# EAGLE schematic contact_control_board (EAGLE 6.5.0)
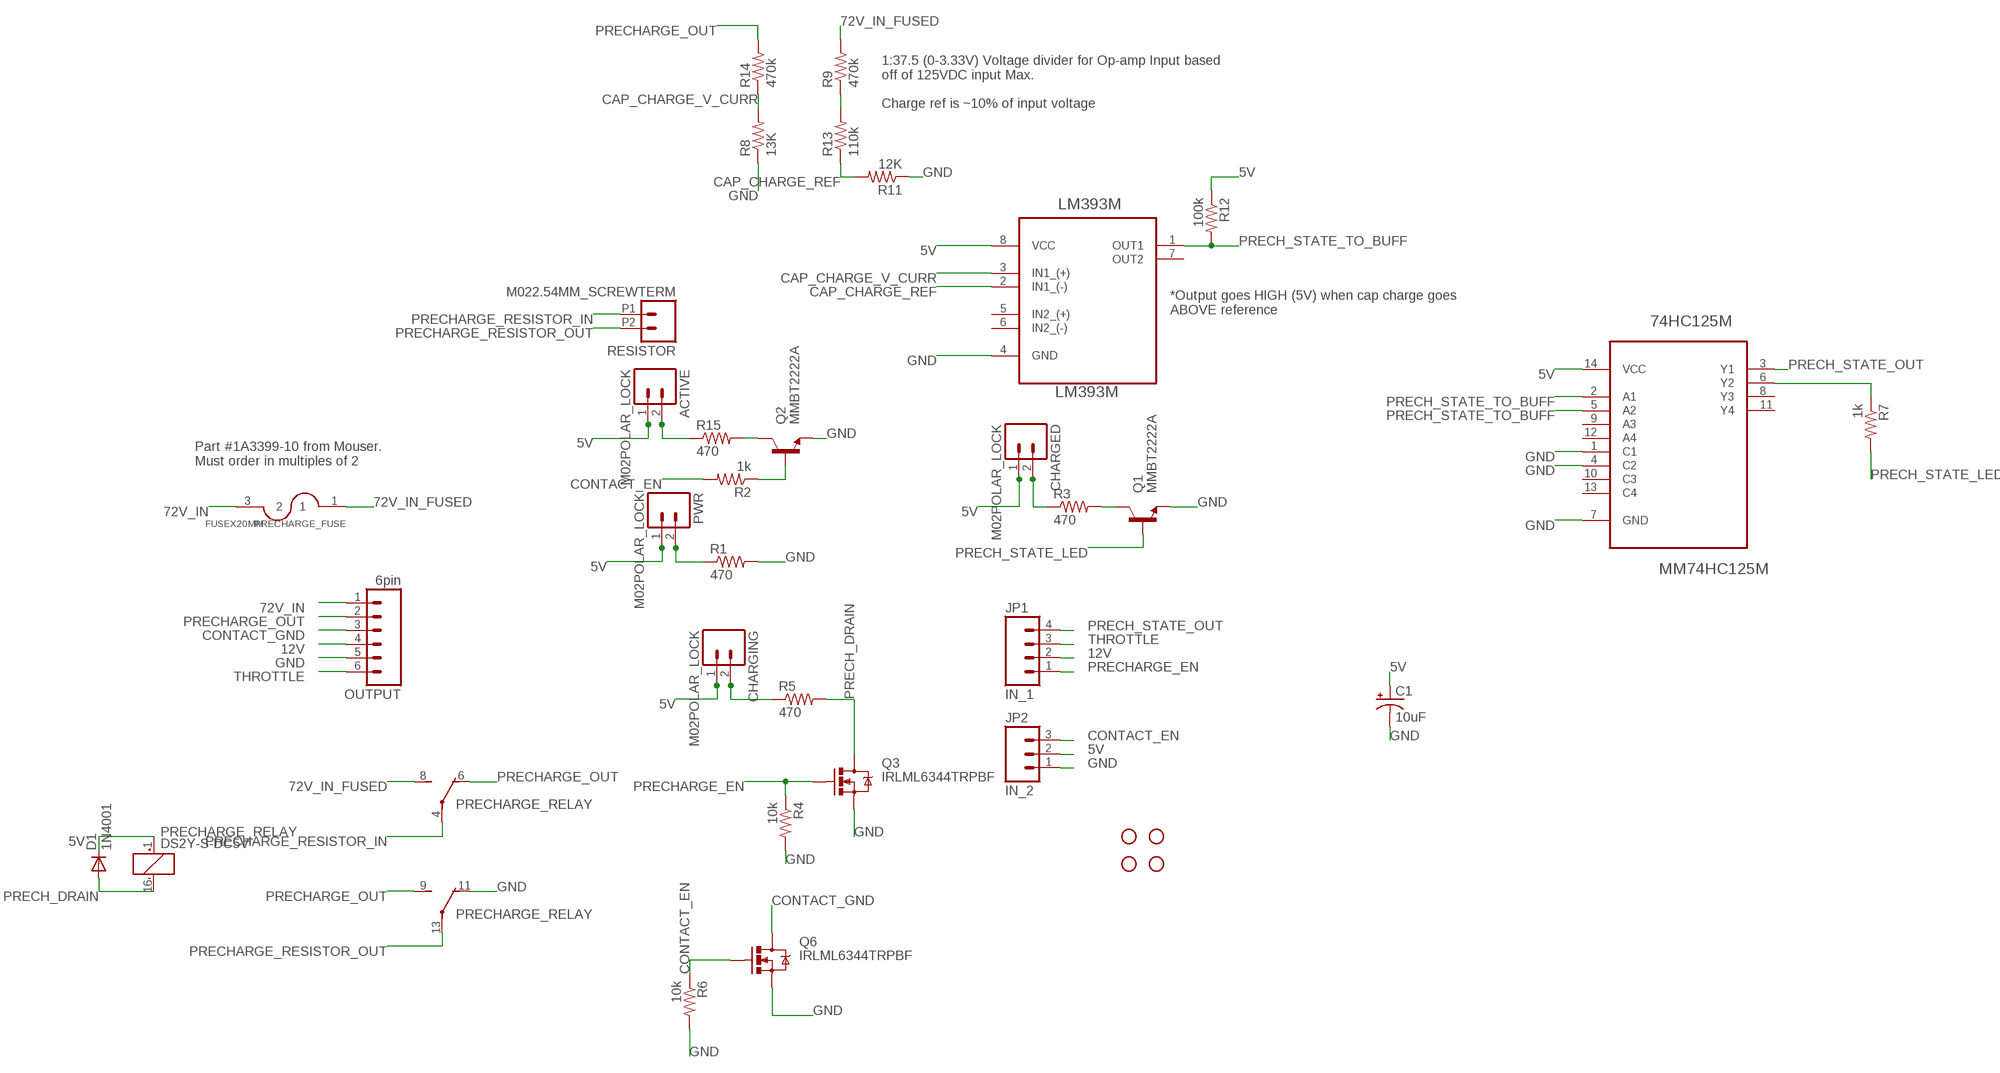
[diagram p0: schematic, sheet 1]

## Parts
74HC125M  MM74HC125M  [SOIC127P600X175-14N]
ACTIVE  M02POLAR_LOCK  [MOLEX-1X2_LOCK]
C1  10uF  CAP_POLPTH2  [CPOL-RADIAL-10UF-25V]
CHARGED  M02POLAR_LOCK  [MOLEX-1X2_LOCK]
CHARGING  M02POLAR_LOCK  [MOLEX-1X2_LOCK]
D1  1N4001  DIODEPTH  [DIODE-1N4001]
JP1  IN_1  M04POLAR_LOCK  [MOLEX-1X4_LOCK]
JP2  IN_2  M03POLAR_LOCK  [MOLEX-1X3_LOCK]
LM393M  LM393M  [SOIC127P600X180-8N]
OUTPUT  6pin  M063.5MM-6  [SCREWTERMINAL-3.5MM-6]
PRECHARGE_FUSE  FUSEX20MM  [FUSE_5MM]
PRECHARGE_RELAY  DS2Y-S-DC5V  [DS2Y]
PWR  M02POLAR_LOCK  [MOLEX-1X2_LOCK]
Q1  MMBT2222A  TRANSISTOR_NPNMMBT2222A  [SOT23]
Q2  MMBT2222A  TRANSISTOR_NPNMMBT2222A  [SOT23]
Q3  IRLML6344TRPBF  MOSFET-NCHANNELBSS123LT1G  [SOT23]
Q6  IRLML6344TRPBF  MOSFET-NCHANNELBSS123LT1G  [SOT23]
R1  470  RESISTOR0805-RES  [0805]
R2  1k  RESISTOR0603-RES  [0603-RES]
R3  470  RESISTOR0805-RES  [0805]
R4  10k  RESISTOR0603-RES  [0603-RES]
R5  470  RESISTOR0805-RES  [0805]
R6  10k  RESISTOR0603-RES  [0603-RES]
R7  1k  RESISTOR0603-RES  [0603-RES]
R8  13K  RESISTOR0805-RES  [0805]
R9  470k  RESISTOR0805-RES  [0805]
R11  12K  RESISTOR0805-RES  [0805]
R12  100k  RESISTOR0603-RES  [0603-RES]
R13  110k  RESISTOR0805-RES  [0805]
R14  470k  RESISTOR0805-RES  [0805]
R15  470  RESISTOR0805-RES  [0805]
RESISTOR  M022.54MM_SCREWTERM  [1X02_2.54_SCREWTERM]
STANDOFF1  STAND-OFF  [STAND-OFF]
STANDOFF2  STAND-OFF  [STAND-OFF]
STANDOFF3  STAND-OFF  [STAND-OFF]
STANDOFF4  STAND-OFF  [STAND-OFF]

## Nets
5V: 74HC125M.14(VCC) ACTIVE.1 C1.1(+) CHARGED.1 CHARGING.1 D1.C JP2.2 LM393M.8(VCC) PRECHARGE_RELAY.1(1:+) PWR.1 R12.1
12V: JP1.2 OUTPUT.4
72V_IN: OUTPUT.1 PRECHARGE_FUSE.3
72V_IN_FUSED: PRECHARGE_FUSE.1 PRECHARGE_RELAY.8(2:S) R9.2
CAP_CHARGE_REF: LM393M.2(IN1_(-)) R11.2 R13.1
CAP_CHARGE_V_CURR: LM393M.3(IN1_(+)) R8.2 R14.1
CONTACT_EN: JP2.3 Q6.1(G) R2.2 R6.1
CONTACT_GND: OUTPUT.3 Q6.3(D)
GND: 74HC125M.1(C1) 74HC125M.4(C2) 74HC125M.7(GND) C1.2(-) JP2.1 LM393M.4(GND) OUTPUT.5 PRECHARGE_RELAY.11(3:O) Q1.2(E) Q2.2(E) Q3.2(S) Q6.2(S) R1.2 R4.2 R6.2 R8.1 R11.1
N$1: Q2.3(C) R15.2
N$2: Q2.1(B) R2.1
N$3: R9.1 R13.2
N$4: CHARGED.2 R3.1
N$5: Q1.3(C) R3.2
N$6: 74HC125M.6(Y2) R7.1
N$7: CHARGING.2 R5.1
N$9: ACTIVE.2 R15.1
N$12: PWR.2 R1.1
PRECH_DRAIN: D1.A PRECHARGE_RELAY.16(1:-) Q3.3(D) R5.2
PRECH_STATE_LED: Q1.1(B) R7.2
PRECH_STATE_OUT: 74HC125M.3(Y1) JP1.4
PRECH_STATE_TO_BUFF: 74HC125M.2(A1) 74HC125M.5(A2) LM393M.1(OUT1) R12.2
PRECHARGE_EN: JP1.1 Q3.1(G) R4.1
PRECHARGE_OUT: OUTPUT.2 PRECHARGE_RELAY.6(2:O) PRECHARGE_RELAY.9(3:S) R14.2
PRECHARGE_RESISTOR_IN: PRECHARGE_RELAY.4(2:P) RESISTOR.P1
PRECHARGE_RESISTOR_OUT: PRECHARGE_RELAY.13(3:P) RESISTOR.P2
THROTTLE: JP1.3 OUTPUT.6
Unconnected: 74HC125M.8(Y3) 74HC125M.9(A3) 74HC125M.10(C3) 74HC125M.11(Y4) 74HC125M.12(A4) 74HC125M.13(C4) LM393M.5(IN2_(+)) LM393M.6(IN2_(-)) LM393M.7(OUT2)

## Notes on the sheet
- 1:37.5 (0-3.33V) Voltage divider for Op-amp Input based
  off of 125VDC input Max.
  
  Charge ref is ~10% of input voltage
- *Output goes HIGH (5V) when cap charge goes
  ABOVE reference
- Part #1A3399-10 from Mouser. 
  Must order in multiples of 2

## Library data of the parts
74HC125M = Fairchild_By_element14_Batch_1:MM74HC125M: 3-STATE Quad Buffers; MPN: MM74HC125M; OC_FARNELL: 1013962; OC_NEWARK: 78K6059; PACKAGE: SOIC-14; SUPPLIER: Fairchild
ACTIVE CHARGED CHARGING PWR RESISTOR = SparkFun-Connectors:M02: Standard 2-pin 0.1" header. Use with - straight break away headers ( PRT-00116) - right angle break away headers (PRT-00553) - swiss pins (PRT-00743) - machine pins (PRT-00117) - female headers (PRT-00115) Molex polarized connector foot print use with: PRT-08233 with associated crimp pins and housings. 2.54_SCREWTERM for use with PRT-10571. 3.5mm Screw Terminal footprints for PRT-08084 5mm Screw Terminal footprints for use with PRT-08433
C1 = SparkFun-Capacitors:CAP_POL: Capacitor Polarized These are standard SMD and PTH capacitors. Normally 10uF, 47uF, and 100uF in electrolytic and tantalum varieties. Always verify the external diameter of the through hole cap, it varies with capacity, voltage, and manufacturer. The EIA devices should be standard.
D1 = SparkFun-DiscreteSemi:DIODE: Diode These are standard reverse protection diodes and small signal diodes. SMA package can handle up to about 1A. SOD-323 can handle about 200mA. What the SOD-323 package when ordering, there are some mfgs out there that are 5-pin packages.
JP1 = SparkFun-Connectors:M04: Header 4 Standard 4-pin 0.1" header. Use with straight break away headers (SKU : PRT-00116), right angle break away headers (PRT-00553), swiss pins (PRT-00743), machine pins (PRT-00117), and female headers (PRT-00115). Molex polarized connector foot print use with SKU : PRT-08231 with associated crimp pins and housings. 1MM SMD Version SKU: PRT-10208
JP2 = SparkFun-Connectors:M03: Header 3 Standard 3-pin 0.1" header. Use with straight break away headers (SKU : PRT-00116), right angle break away headers (PRT-00553), swiss pins (PRT-00743), machine pins (PRT-00117), and female headers (PRT-00115). Molex polarized connector foot print use with SKU : PRT-08232 with associated crimp pins and housings.
LM393M = Fairchild_By_element14_Batch_1:LM393M: Dual Differential Comparator; MPN: LM393M; OC_FARNELL: 9487590; OC_NEWARK: 78K6008; PACKAGE: SO-8; SUPPLIER: FAIRCHILD SEMICONDUCTOR
OUTPUT = SparkFun-Connectors:M06: Header 6 Standard 6-pin 0.1" header. Use with straight break away headers (SKU : PRT-00116), right angle break away headers (PRT-00553), swiss pins (PRT-00743), machine pins (PRT-00117), and female headers (PRT-00115). Molex polarized connector foot print use with SKU : PRT-08094 with associated crimp pins and housings. NOTES ON THE VARIANTS LOCK and LOCK_LONGPADS... This footprint was designed to help hold the alignment of a through-hole component (i.e. 6-pin header) while soldering it into place. You may notice that each hole has been shifted either up or down by 0.005 of an inch from it's more standard position (which is a perfectly straight line). This slight alteration caused the pins (the squares in the middle) to touch the edges of the holes. Because they are alternating, it causes a "brace" to hold the component in place. 0.005 has proven to be the perfect amount of "off-center" position when using our standard breakaway headers. Although looks a little odd when you look at the bare footprint, once you have a header in there, the alteration is very hard to notice. Also,if you push a header all the way into place, it is covered up entirely on the bottom side. This idea of altering the position of holes to aid alignment will be further integrated into the Sparkfun Library for other footprints. It can help hold any component with 3 or more connection pins.
PRECHARGE_FUSE = SparkFun-Passives:FUSE
PRECHARGE_RELAY = relay:DS2Y-S-DC*: MINIATURE RELAY NAiS Source: http://www.mew-europe.com/.. en_ds_61005_0023.pdf; MPN: DS2Y-S-DC5V; OC_FARNELL: unknown; OC_NEWARK: 13P3268
Q1 Q2 = SparkFun-DiscreteSemi:TRANSISTOR_NPN: Generic NPN BJT MMBT2222A - TRANS-08049 (SOT-23, 1A 40V) MPSA42 - TRANS-09116 (SOT-23, 500mA 300V) MMBT5088LT1G - TRANS-11160 (SOT-23, 50 mA 30V); PROD_ID: TRANS-08049
Q3 Q6 = SparkFun-DiscreteSemi:MOSFET-NCHANNEL: Common NMOSFET Parts MFG P/N Store ID Prod ID FDD8780 TRANS-09984 SI7820DN TRANS-11055 FDS6630A IC-08089 2N7002PW TRANS-11151 FQP30N06L COM-10213 TRANS-10060 BSS123LT1G TRANS-08345 BSS138 TRANS-00830 BS170 2N7000; PROD_ID: TRANS-08345
R1-R9 R11-R15 = SparkFun-Resistors:RESISTOR: Resistor Basic schematic elements and footprints for 0603, 1206, and PTH resistors.
STANDOFF1-STANDOFF4 = SparkFun-Electromechanical:STAND-OFF: #4 Stand Off This is the mechanical footprint for a #4 phillips button head screw. Use the keepout ring to avoid running the screw head into surrounding components. SKU : PRT-00447